# EAGLE board MotherBoard (EAGLE 8.1.0)
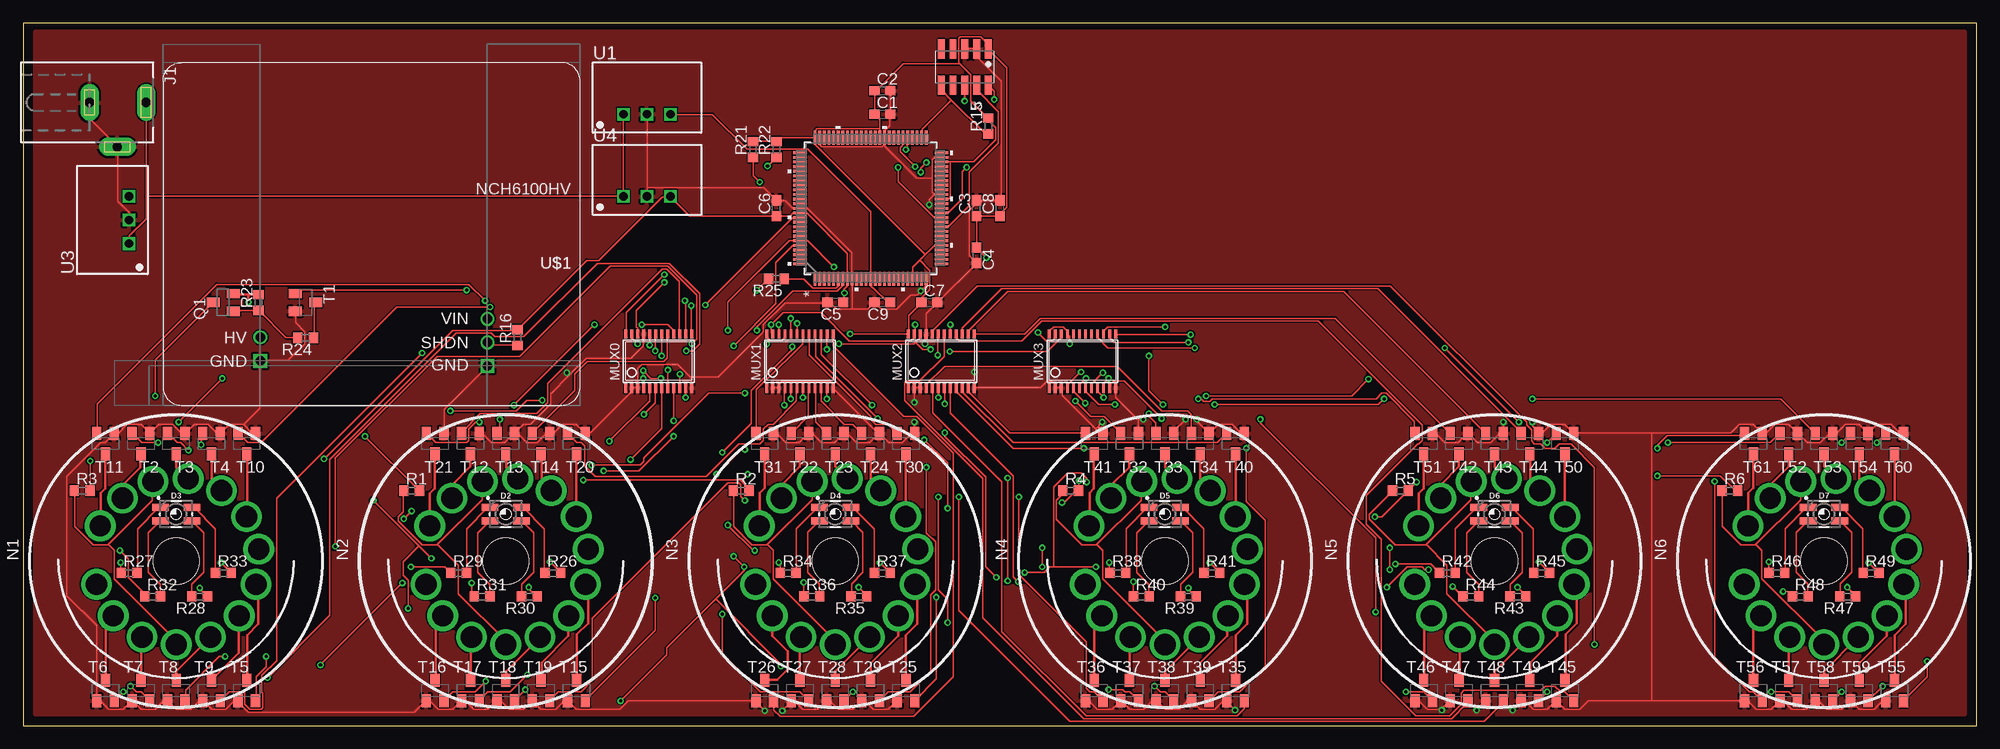
[diagram p6: board, top side]
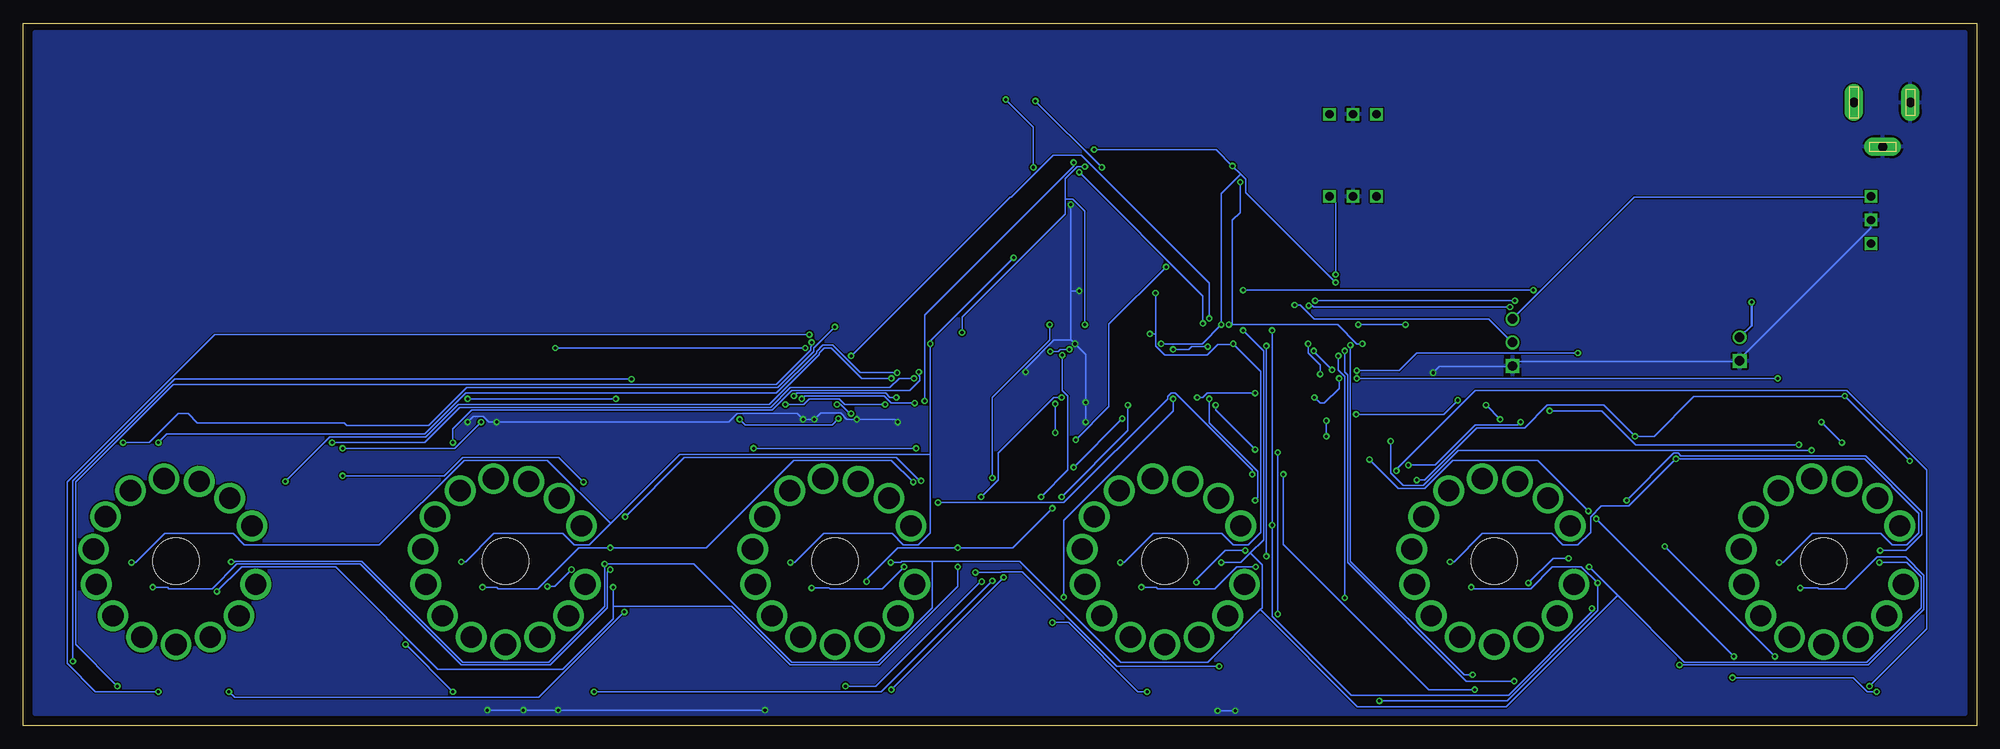
[diagram p7: board, bottom side, seen from below]

Size 210.8 x 75.87 mm. Coordinates in mm from the lower left corner, seen from the top.
Outline: 0,0 210.8,0 210.8,75.87 0,75.87 0,0
Copper layers (1*16): Top 0.0356mm / dielectric 1.5011mm / Bottom 0.0356mm
Design rules "oshpark-2layer": minimum track width 6mil, minimum drill 13mil, track to track 6mil, track to pad 6mil, pad to pad 6mil, via to via 6mil, smd to smd 6mil, copper to edge 15mil, drill to drill 6mil, minimum pad ring 7mil, minimum via ring 7mil, stop-mask expansion 2.5mil, vias tented up to drill 0mil, thermal gap 10mil
Net classes: 1 HV: width 0.254 mm, drill 0.254 mm, clearance 0.254 mm to class 0, clearance 0.254 mm

## Footprints (pad centres in the part's own frame; a part is rotated, then mirrored left to right if it is on the bottom)
C0603 = smd 1.1 x 1: 1 -0.85,0; 2 0.85,0
P-LCC-4-3 = smd 1.8 x 0.75: 1 -1.7,0.725; 2 -1.7,-0.725; 3 1.7,-0.725; 4 1.7,0.725
DCJ0202 = drill 1 pad 2 long: 1 0,3.1; 2 4.8,0; 3 0,-3
621X1021021 = smd 0.75 x 2.1: 1 -2.54,-1.95; 2 -1.27,-1.95; 3 0,-1.95; 4 1.27,-1.95; 5 2.54,-1.95; 6 2.54,1.95; 7 1.27,1.95; 8 0,1.95; 9 -1.27,1.95; 10 -2.54,1.95
TSSOP24 = smd 0.305 x 0.991: 1 -3.575,-2.918; 2 -2.925,-2.918; 3 -2.275,-2.918; 4 -1.625,-2.918; 5 -0.975,-2.918; 6 -0.325,-2.918; 7 0.325,-2.918; 8 0.975,-2.918; 9 1.625,-2.918; 10 2.275,-2.918; 11 2.925,-2.918; 12 3.575,-2.918; 13 3.575,2.918; 14 2.925,2.918; 15 2.275,2.918; 16 1.625,2.918; 17 0.975,2.918; 18 0.325,2.918; 19 -0.325,2.918; 20 -0.975,2.918; 21 -1.625,2.918; 22 -2.275,2.918; 23 -2.925,2.918; 24 -3.575,2.918
IN-18 = drill 2.3 pad 3.2: 0 5.8,-6.8; 1 -1.3,-8.9; 2 -4.9,-7.6; 3 -8.6,2.5; 4 6.8,5.9; 5 3.7,8.2; 6 -3.7,8.2; 7 -6.8,5.9; 8 -7.6,-4.8; 9 8.2,-3.8; A 0,9; A2 2.5,-8.6; N/C 8.6,2.5; N/C2 -8.9,-1.3 | hole 5: 0,0
SOT23 = smd 1 x 1.4: 1 -0.95,-1.1; 2 0.95,-1.1; 3 0,1.1
R0603 = smd 1 x 1.1: 1 -0.85,0; 2 0.85,0
SOT23-BEC = smd 1 x 1.4: B -0.95,-1.1; C 0,1.1; E 0.95,-1.1
SOT23-EBC = smd 1 x 1.4: B 0.95,-1.1; C 0,1.1; E -0.95,-1.1
TSR-1 = drill 0.9 square: 1 -2.54,0; 2 0,0; 3 2.54,0
LQFP-100_14X14X1.7 = smd 1.461 x 0.3: 1 -7.625,6; 2 -7.625,5.5; 3 -7.625,5; 4 -7.625,4.5; 5 -7.625,4; 6 -7.625,3.5; 7 -7.625,3; 8 -7.625,2.5; 9 -7.625,2; 10 -7.625,1.5; 11 -7.625,1; 12 -7.625,0.5; 13 -7.625,0; 14 -7.625,-0.5; 15 -7.625,-1; 16 -7.625,-1.5; 17 -7.625,-2; 18 -7.625,-2.5; 19 -7.625,-3; 20 -7.625,-3.5; 21 -7.625,-4; 22 -7.625,-4.5; 23 -7.625,-5; 24 -7.625,-5.5; 25 -7.625,-6; 51 7.625,-6; 52 7.625,-5.5; 53 7.625,-5; 54 7.625,-4.5; 55 7.625,-4; 56 7.625,-3.5; 57 7.625,-3; 58 7.625,-2.5; 59 7.625,-2; 60 7.625,-1.5; 61 7.625,-1; 62 7.625,-0.5; 63 7.625,0; 64 7.625,0.5; 65 7.625,1; 66 7.625,1.5; 67 7.625,2; 68 7.625,2.5; 69 7.625,3; 70 7.625,3.5; 71 7.625,4; 72 7.625,4.5; 73 7.625,5; 74 7.625,5.5; 75 7.625,6 | smd 0.3 x 1.461: 26 -6,-7.625; 27 -5.5,-7.625; 28 -5,-7.625; 29 -4.5,-7.625; 30 -4,-7.625; 31 -3.5,-7.625; 32 -3,-7.625; 33 -2.5,-7.625; 34 -2,-7.625; 35 -1.5,-7.625; 36 -1,-7.625; 37 -0.5,-7.625; 38 0,-7.625; 39 0.5,-7.625; 40 1,-7.625; 41 1.5,-7.625; 42 2,-7.625; 43 2.5,-7.625; 44 3,-7.625; 45 3.5,-7.625; 46 4,-7.625; 47 4.5,-7.625; 48 5,-7.625; 49 5.5,-7.625; 50 6,-7.625; 76 6,7.625; 77 5.5,7.625; 78 5,7.625; 79 4.5,7.625; 80 4,7.625; 81 3.5,7.625; 82 3,7.625; 83 2.5,7.625; 84 2,7.625; 85 1.5,7.625; 86 1,7.625; 87 0.5,7.625; 88 0,7.625; 89 -0.5,7.625; 90 -1,7.625; 91 -1.5,7.625; 92 -2,7.625; 93 -2.5,7.625; 94 -3,7.625; 95 -3.5,7.625; 96 -4,7.625; 97 -4.5,7.625; 98 -5,7.625; 99 -5.5,7.625; 100 -6,7.625
NCH6100-STD = drill 1 square: GND -12,15.75; GNDO 12.5,15.2 | drill 1: SHDN -12,13.21; VH 12.5,12.66; VIN -12,10.67

## Placement (x,y rotation side)
C1  0.1µF  [C0603]  92.71,66.04 0 top
C2  0.1µF  [C0603]  92.71,68.58 0 top
C3  0.1µF  [C0603]  102.87,55.88 90 top
C4  0.1µF  [C0603]  102.87,50.8 270 top
C5  0.1µF  [C0603]  87.63,45.72 180 top
C6  0.1µF  [C0603]  81.28,55.88 90 top
C7  0.1µF  [C0603]  97.79,45.72 0 top
C8  0.1µF  [C0603]  105.41,55.88 90 top
C9  10µF  [C0603]  92.71,45.72 180 top
D2  CLV1A-FKB-CJ1M1F1BB7R4S3  [P-LCC-4-3]  52.07,22.86 0 top
D3  CLV1A-FKB-CJ1M1F1BB7R4S3  [P-LCC-4-3]  16.51,22.86 0 top
D4  CLV1A-FKB-CJ1M1F1BB7R4S3  [P-LCC-4-3]  87.63,22.86 0 top
D5  CLV1A-FKB-CJ1M1F1BB7R4S3  [P-LCC-4-3]  123.19,22.86 0 top
D6  CLV1A-FKB-CJ1M1F1BB7R4S3  [P-LCC-4-3]  158.75,22.86 0 top
D7  CLV1A-FKB-CJ1M1F1BB7R4S3  [P-LCC-4-3]  194.31,22.86 0 top
J1  DCJ0202  [DCJ0202]  10.16,67.31 270 top
J2  M50-3600542  [621X1021021]  101.6,71.12 180 top
MUX0  PCA9555PW  [TSSOP24]  68.58,39.37 0 top
MUX1  PCA9555PW  [TSSOP24]  83.82,39.37 0 top
MUX2  PCA9555PW  [TSSOP24]  99.06,39.37 0 top
MUX3  PCA9555PW  [TSSOP24]  114.3,39.37 0 top
N1  IN-18  [IN-18]  16.51,17.78 180 top
N2  IN-18  [IN-18]  52.07,17.78 180 top
N3  IN-18  [IN-18]  87.63,17.78 180 top
N4  IN-18  [IN-18]  123.19,17.78 180 top
N5  IN-18  [IN-18]  158.75,17.78 180 top
N6  IN-18  [IN-18]  194.31,17.78 180 top
Q1  MPSA92  [SOT23]  21.59,45.72 90 top
R1  6.8k  [R0603]  41.91,25.4 0 top
R2  6.8k  [R0603]  77.47,25.4 0 top
R3  6.8k  [R0603]  6.35,25.4 0 top
R4  6.8k  [R0603]  113.03,25.4 0 top
R5  6.8k  [R0603]  148.59,25.4 0 top
R6  6.8k  [R0603]  184.15,25.4 0 top
R15  10k  [R0603]  104.14,64.77 90 top
R16  4.7k  [R0603]  53.34,41.91 90 top
R21  4.7k  [R0603]  78.74,62.23 90 top
R22  4.7k  [R0603]  81.28,62.23 90 top
R23  100k  [R0603]  25.4,45.72 90 top
R24  470k  [R0603]  30.48,41.91 180 top
R25  33k  [R0603]  81.28,48.26 180 top
R26  130  [R0603]  57.15,16.51 0 top
R27  576  [R0603]  11.43,16.51 0 top
R28  270  [R0603]  19.05,13.97 180 top
R29  576  [R0603]  46.99,16.51 0 top
R30  270  [R0603]  54.61,13.97 180 top
R31  270  [R0603]  49.53,13.97 0 top
R32  270  [R0603]  13.97,13.97 0 top
R33  130  [R0603]  21.59,16.51 0 top
R34  576  [R0603]  82.55,16.51 0 top
R35  270  [R0603]  90.17,13.97 180 top
R36  270  [R0603]  85.09,13.97 0 top
R37  130  [R0603]  92.71,16.51 0 top
R38  576  [R0603]  118.11,16.51 0 top
R39  270  [R0603]  125.73,13.97 180 top
R40  270  [R0603]  120.65,13.97 0 top
R41  130  [R0603]  128.27,16.51 0 top
R42  576  [R0603]  153.67,16.51 0 top
R43  270  [R0603]  161.29,13.97 180 top
R44  270  [R0603]  156.21,13.97 0 top
R45  130  [R0603]  163.83,16.51 0 top
R46  576  [R0603]  189.23,16.51 0 top
R47  270  [R0603]  196.85,13.97 180 top
R48  270  [R0603]  191.77,13.97 0 top
R49  130  [R0603]  199.39,16.51 0 top
T1  MPSA42  [SOT23-BEC]  30.48,45.72 270 top
T2  DN350T05-7  [SOT23-EBC]  12.7,30.48 180 top
T3  DN350T05-7  [SOT23-EBC]  16.51,30.48 180 top
T4  DN350T05-7  [SOT23-EBC]  20.32,30.48 180 top
T5  DN350T05-7  [SOT23-EBC]  24.13,3.81 0 top
T6  DN350T05-7  [SOT23-EBC]  8.89,3.81 0 top
T7  DN350T05-7  [SOT23-EBC]  12.7,3.81 0 top
T8  DN350T05-7  [SOT23-EBC]  16.51,3.81 0 top
T9  DN350T05-7  [SOT23-EBC]  20.32,3.81 0 top
T10  DN350T05-7  [SOT23-EBC]  24.13,30.48 180 top
T11  DN350T05-7  [SOT23-EBC]  8.89,30.48 180 top
T12  DN350T05-7  [SOT23-EBC]  48.26,30.48 180 top
T13  DN350T05-7  [SOT23-EBC]  52.07,30.48 180 top
T14  DN350T05-7  [SOT23-EBC]  55.88,30.48 180 top
T15  DN350T05-7  [SOT23-EBC]  59.69,3.81 0 top
T16  DN350T05-7  [SOT23-EBC]  44.45,3.81 0 top
T17  DN350T05-7  [SOT23-EBC]  48.26,3.81 0 top
T18  DN350T05-7  [SOT23-EBC]  52.07,3.81 0 top
T19  DN350T05-7  [SOT23-EBC]  55.88,3.81 0 top
T20  DN350T05-7  [SOT23-EBC]  59.69,30.48 180 top
T21  DN350T05-7  [SOT23-EBC]  44.45,30.48 180 top
T22  DN350T05-7  [SOT23-EBC]  83.82,30.48 180 top
T23  DN350T05-7  [SOT23-EBC]  87.63,30.48 180 top
T24  DN350T05-7  [SOT23-EBC]  91.44,30.48 180 top
T25  DN350T05-7  [SOT23-EBC]  95.25,3.81 0 top
T26  DN350T05-7  [SOT23-EBC]  80.01,3.81 0 top
T27  DN350T05-7  [SOT23-EBC]  83.82,3.81 0 top
T28  DN350T05-7  [SOT23-EBC]  87.63,3.81 0 top
T29  DN350T05-7  [SOT23-EBC]  91.44,3.81 0 top
T30  DN350T05-7  [SOT23-EBC]  95.25,30.48 180 top
T31  DN350T05-7  [SOT23-EBC]  80.01,30.48 180 top
T32  DN350T05-7  [SOT23-EBC]  119.38,30.48 180 top
T33  DN350T05-7  [SOT23-EBC]  123.19,30.48 180 top
T34  DN350T05-7  [SOT23-EBC]  127,30.48 180 top
T35  DN350T05-7  [SOT23-EBC]  130.81,3.81 0 top
T36  DN350T05-7  [SOT23-EBC]  115.57,3.81 0 top
T37  DN350T05-7  [SOT23-EBC]  119.38,3.81 0 top
T38  DN350T05-7  [SOT23-EBC]  123.19,3.81 0 top
T39  DN350T05-7  [SOT23-EBC]  127,3.81 0 top
T40  DN350T05-7  [SOT23-EBC]  130.81,30.48 180 top
T41  DN350T05-7  [SOT23-EBC]  115.57,30.48 180 top
T42  DN350T05-7  [SOT23-EBC]  154.94,30.48 180 top
T43  DN350T05-7  [SOT23-EBC]  158.75,30.48 180 top
T44  DN350T05-7  [SOT23-EBC]  162.56,30.48 180 top
T45  DN350T05-7  [SOT23-EBC]  166.37,3.81 0 top
T46  DN350T05-7  [SOT23-EBC]  151.13,3.81 0 top
T47  DN350T05-7  [SOT23-EBC]  154.94,3.81 0 top
T48  DN350T05-7  [SOT23-EBC]  158.75,3.81 0 top
T49  DN350T05-7  [SOT23-EBC]  162.56,3.81 0 top
T50  DN350T05-7  [SOT23-EBC]  166.37,30.48 180 top
T51  DN350T05-7  [SOT23-EBC]  151.13,30.48 180 top
T52  DN350T05-7  [SOT23-EBC]  190.5,30.48 180 top
T53  DN350T05-7  [SOT23-EBC]  194.31,30.48 180 top
T54  DN350T05-7  [SOT23-EBC]  198.12,30.48 180 top
T55  DN350T05-7  [SOT23-EBC]  201.93,3.81 0 top
T56  DN350T05-7  [SOT23-EBC]  186.69,3.81 0 top
T57  DN350T05-7  [SOT23-EBC]  190.5,3.81 0 top
T58  DN350T05-7  [SOT23-EBC]  194.31,3.81 0 top
T59  DN350T05-7  [SOT23-EBC]  198.12,3.81 0 top
T60  DN350T05-7  [SOT23-EBC]  201.93,30.48 180 top
T61  DN350T05-7  [SOT23-EBC]  186.69,30.48 180 top
U1  TSR_1-2450  [TSR-1]  67.31,66.04 0 top
U2  MK64FN1M0VLL12  [LQFP-100_14X14X1.7]  91.44,55.88 90 top
U3  TSR_1-24120  [TSR-1]  11.43,54.61 90 top
U4  TSR_1-2433  [TSR-1]  67.31,57.15 0 top
U$1  NCH6100HV  [NCH6100-STD]  38.1,54.61 180 top

## Tracks (layer width: path | path; a pad name or v marks a point on that pad's centre or on a via)
12VDC
  Bottom 0.152: U3.3 11.43,57.1 36.96,57.1 50.06,43.99 U$1.VIN
19VIN
  Top 0.152: U1.1 64.77,57.17 | U3.1 11.43,52.91 13.26,54.74 13.26,57.17 | 13.26,57.17 J1.1 | 13.26,57.17 64.77,57.17 | 64.77,57.17 U4.1
GND  (via drill 0.33)
  Top 0.152: T51.E 152.09,31.57 152.4,31.57 153.39,30.58 154.84,30.58 155.83,31.57 T42.E 155.91,31.57 156.9,30.58 158.34,30.58 159.33,31.57 159.64,31.57 T43.E 159.72,31.65 v159.72,32.79 | T60.E 202.84,31.65 202.46,31.65 201.55,32.56 200.03,32.56 199.11,31.65 T54.E 199.03,31.65 198.12,32.56 196.6,32.56 195.68,31.65 195.3,31.65 T53.E 195.22,31.57 194.92,31.57 193.93,30.58 192.48,30.58 191.49,31.57 T52.E 191.41,31.65 190.5,32.56 188.98,32.56 188.06,31.65 187.68,31.65 T61.E 187.6,31.65 186.69,32.56 185.17,32.56 184.25,31.65 175.72,31.65 | 175.72,31.65 167.34,31.65 T50.E 167.26,31.65 166.34,32.56 164.82,32.56 163.91,31.65 163.53,31.65 T44.E 163.53,31.73 162.84,32.41 v162.84,32.79 | T55.E 200.94,2.69 200.63,2.69 199.72,1.78 198.12,1.78 197.21,2.69 T59.E 197.13,2.69 196.22,1.78 194.62,1.78 193.7,2.69 193.4,2.69 T58.E 193.32,2.69 192.41,1.78 190.81,1.78 189.89,2.69 189.59,2.69 T57.E 189.51,2.69 188.59,1.78 187,1.78 186.08,2.69 185.78,2.69 T56.E 185.7,2.69 175.72,2.69 | T36.E 114.68,2.69 114.99,2.69 115.9,1.78 117.5,1.78 118.42,2.69 T37.E 118.49,2.69 119.41,1.78 120.93,1.78 121.84,2.69 122.22,2.69 T38.E 122.3,2.69 123.22,1.78 124.74,1.78 125.65,2.69 126.03,2.69 T39.E 126.11,2.69 127.03,1.78 128.55,1.78 129.46,2.69 129.84,2.69 T35.E 129.84,2.62 v130.76,1.7 | 153.05,1.82 153.92,2.69 T47.E | 153.05,1.82 153.01,1.78 151.49,1.78 150.57,2.69 150.19,2.69 T46.E | v156.82,1.7 156.82,1.78 157.73,2.69 T48.E | v153.09,1.7 153.09,1.78 153.05,1.82 | v160.71,1.7 161.62,2.62 T49.E 161.62,2.69 162,2.69 162.92,1.78 164.44,1.78 165.35,2.69 T45.E 165.43,2.69 166.34,1.78 167.94,1.78 168.86,2.69 175.72,2.69
  Top 0.152: 175.72,2.69 175.72,31.65 | 120.28,33.06 120.32,33.02 120.32,31.65 T32.E | 120.28,33.06 117.88,35.46 MUX3.12 | v125.42,33.1 124.21,31.88 124.21,31.65 T33.E | v126.64,33.1 126.64,32.94 127.94,31.65 T34.E 128.02,31.65 128.93,32.56 130.45,32.56 131.37,31.65 131.75,31.65 T40.E | v120.85,33.1 120.32,33.1 120.28,33.06 | 115.71,32.07 112.09,35.69 112.09,36.45 MUX3.3 112.01,36.52 111.4,36.52 MUX3.2 111.33,36.52 111.33,36.83 110.95,37.21 110.49,37.21 109.8,36.52 102.64,36.52 MUX2.12 102.64,36.6 v102.64,38.2 | 115.71,32.07 116.13,31.65 116.51,31.65 T41.E | 115.71,32.07 v116.43,32.79 | 98.26,57.44 98.07,57.63 98.07,59.16 | 98.26,57.44 98.3,57.4 99.06,57.4 U2.41 | 98.07,59.16 98.07,61.14 98.3,61.37 99.06,61.37 U2.49 | C2.2 93.57,68.53 93.57,66.09 C1.2 93.5,66.02 93.5,64.8 92.96,64.26 92.96,63.58 U2.60 92.89,63.5 92.89,62.74 92.85,62.7 | 92.85,62.7 92.66,62.51 86.18,62.51 85.95,62.74 85.95,63.5 U2.74 | 98.07,59.16 96.39,59.16 92.85,62.7 | MUX1.2 80.92,36.52 81.53,36.52 MUX1.3 81.53,36.6 81.53,36.83 81.92,37.21 87.02,37.21 87.33,36.91 87.33,36.52 MUX1.12 92.28,31.57 T24.E | MUX2.3 96.77,36.52 96.16,36.52 MUX2.2 96.16,36.45 v96.16,34.92 | v96.16,32.79 96.16,31.65 T30.E 96.09,31.65 95.94,31.65 94.87,30.58 93.42,30.58 92.43,31.57 T24.E | T31.E 81,31.57 81.31,31.57 82.3,30.58 83.74,30.58 84.73,31.57 T22.E 84.81,31.57 85.11,31.57 86.11,30.58 87.55,30.58 88.54,31.57 T23.E 88.62,31.57 88.92,31.57 89.92,30.58 91.36,30.58 92.35,31.57 T24.E | J2.3 101.65,73.1 102.87,73.1 J2.2 102.87,72.26 105.54,69.6 105.54,56.87 105.46,56.79 C8.2 105.39,56.72 102.87,56.72 | 102.87,56.72 102.87,56.41 102.11,55.65 102.11,50.77 102.87,50.01 C4.2 102.87,49.94 98.68,45.74 C7.2 98.6,45.67 97.46,44.53 97.46,42.32 MUX2.21 97.38,42.24 97.31,42.16 v97.31,41.25
  Top 0.152: 102.87,56.72 C3.2 | v97.77,56.26 97.77,56.79 98.22,57.25 98.22,57.4 98.26,57.44 | T25.E 94.26,2.69 93.34,1.78 91.75,1.78 90.83,2.69 90.53,2.69 T29.E 90.45,2.69 89.53,1.78 87.94,1.78 87.02,2.69 86.72,2.69 T28.E 86.64,2.69 85.72,1.78 84.12,1.78 83.21,2.69 82.91,2.69 T27.E 82.91,2.62 v81.92,1.63 | v80.01,1.63 79.02,2.62 T26.E 79.02,2.69 65.3,2.69 64.39,1.78 59.66,1.78 58.75,2.69 T15.E 58.67,2.69 58.37,2.69 57.45,1.78 55.85,1.78 54.94,2.69 T19.E 54.86,2.69 53.95,1.78 52.43,1.78 51.51,2.69 51.13,2.69 T18.E 51.05,2.69 50.14,1.78 48.62,1.78 47.7,2.69 47.32,2.69 T17.E 47.24,2.69 46.33,1.78 44.81,1.78 43.89,2.69 43.51,2.69 T16.E 43.43,2.69 42.22,1.47 24.31,1.47 23.16,2.62 T5.E 23.16,2.69 22.78,2.69 21.87,1.78 20.34,1.78 19.43,2.69 T9.E 19.36,2.69 18.97,2.69 18.06,1.78 16.54,1.78 15.62,2.69 T8.E 15.54,2.69 15.16,2.69 14.25,1.78 12.72,1.78 11.81,2.69 T7.E 11.73,2.69 10.82,1.78 9.22,1.78 8.31,2.69 8,2.69 T6.E 7.92,2.77 7.92,10.85 4.72,14.05 4.72,26.92 8.38,30.58 8.84,30.58 T11.E 9.91,31.65 10.29,31.65 11.2,32.56 12.72,32.56 13.64,31.65 T2.E 13.72,31.65 14.63,32.56 16.15,32.56 17.07,31.65 17.45,31.65 T3.E 17.53,31.65 18.44,32.56 19.96,32.56 20.88,31.65 21.26,31.65 T4.E 21.34,31.65 22.25,32.56 23.77,32.56 23.81,32.52 | U3.2 11.43,55.42 10.21,56.64 10.21,62.51 J1.2 10.13,62.59 7.16,65.56 J1.3 | T1.E 29.41,44.76 29.41,43.54 30.4,42.55 30.4,41.25 28.57,39.42 U$1.GNDO 25.53,39.34 25.53,34.24 23.81,32.52 | 23.81,32.52 24.69,31.65 25.07,31.65 T10.E | T21.E 45.41,31.65 45.41,34.16 50.06,38.81 U$1.GND | 72.05,37.63 70.64,39.04 66.75,39.04 66.29,38.58 66.29,36.6 MUX0.3 66.29,36.52 65.68,36.52 MUX0.2 65.61,36.45 65.61,36.07 61.19,31.65 60.66,31.65 T20.E 60.58,31.65 59.66,32.56 58.14,32.56 57.23,31.65 56.84,31.65 T14.E 56.77,31.57 56.46,31.57 55.47,30.58 54.33,30.58 53.19,31.73 T13.E
  Top 0.152: 72.05,37.63 72.08,37.59 72.08,36.52 MUX0.12 | 58.94,37.86 56.92,35.84 56.92,34.77 54.71,32.56 53.95,32.56 53.03,31.65 T13.E | 58.94,37.86 60.73,39.65 65.53,39.65 66.9,41.02 66.9,42.24 MUX0.21 | T12.E 49.23,31.57 49.53,31.57 50.52,30.58 51.97,30.58 52.96,31.57 T13.E | 58.94,37.86 v58.67,38.12 | 67.36,58.09 67.36,66.02 U1.2 | 67.36,58.09 67.36,57.17 U4.2 | 89.46,44.98 91.14,44.98 91.82,45.67 C9.2 91.9,45.67 92.58,44.98 94.26,44.98 95.78,46.51 96.47,46.51 96.89,46.93 | 89.46,44.98 87.78,44.98 87.1,45.67 86.79,45.67 C5.2 86.72,45.67 82.22,45.67 79.86,43.31 79.86,42.55 74.98,37.67 72.08,37.67 72.05,37.63 | 89.46,44.98 89.46,48.18 U2.9 89.38,48.26 89.38,51.08 84.58,55.88 U2.88 83.06,55.88 82.22,56.72 81.31,56.72 C6.2 81.23,56.79 79.93,58.09 67.36,58.09 | 96.89,46.93 97.38,47.42 97.38,48.18 U2.25 | v96.85,46.97 96.89,46.93
  Bottom 0.152: v162.84,32.79 162.23,33.4 161.16,33.4 160.55,32.79 v159.72,32.79 134.65,32.79 133.73,33.71 127.25,33.71 v126.64,33.1 v125.42,33.1 124.74,33.78 122.61,33.78 121.92,33.1 v120.85,33.1 116.74,33.1 v116.43,32.79 | v160.71,1.7 v156.82,1.7 v153.09,1.7 v130.76,1.7 | v96.16,32.79 v96.16,34.92 96.16,40.11 v97.31,41.25 97.73,41.67 | 97.77,46.97 97.77,41.71 97.73,41.67 | 97.77,46.97 v97.77,56.26 | v102.64,38.2 102.64,38.58 99.59,41.63 97.77,41.63 97.73,41.67 | v80.01,1.63 v81.92,1.63 | U3.2 11.43,53.75 25.53,39.65 25.53,39.42 U$1.GNDO 25.6,39.34 49.61,39.34 50.06,38.89 U$1.GND 50.14,38.81 57.99,38.81 v58.67,38.12 | v96.85,46.97 97.77,46.97
  pour Bottom: 1.27,1.27 209.55,1.27 209.55,74.93 1.27,74.93
  pour Top: 1.27,1.27 209.55,1.27 209.55,74.93 1.27,74.93
LED_B  (via drill 0.33)
  Top 0.152: v19.05,14.88 19.05,14.81 19.89,13.97 R28.1 | v40.92,15.42 v32.08,6.58 | v54.56,14.96 54.56,14.81 55.4,13.97 R30.1 | v90.14,14.96 90.98,14.12 90.98,13.97 R35.1 | 74.71,13.7 69.42,8.41 69.42,7.64 v64.47,2.69 | 74.71,13.7 77.8,16.79 v77.8,17.17 v76.66,18.31 | v125.73,14.88 125.73,14.81 126.57,13.97 R39.1 | 111.18,17.17 110.8,17.17 110.19,16.56 v108.05,16.56 | 111.18,17.17 v115.75,17.17 | v81.76,6.43 81.76,6.66 74.71,13.7 | v161.24,14.96 162.08,14.12 162.08,13.97 R43.1 | v114.76,26.31 114.76,26.7 114.15,27.3 112.7,27.3 111.18,25.78 111.18,17.17 | v196.82,14.96 197.66,14.12 197.66,13.97 R47.1 | v147.45,19.23 v147.45,16.87 | v76.66,41.02 81.23,45.59 81.23,50.01 83.06,51.84 83.74,51.84 U2.96
  Bottom 0.152: v19.05,14.88 17.14,14.88 17.07,14.81 14.17,14.81 10.74,18.24 7.7,18.24 5.71,16.26 5.71,12.6 11.73,6.58 v32.08,6.58 | v54.56,14.96 54.41,14.81 48.16,14.81 45.8,17.17 42.67,17.17 v40.92,15.42 40.92,12.45 50.67,2.69 v64.47,2.69 | v90.14,14.96 88.54,14.96 88.39,14.81 82.22,14.81 79.86,17.17 v77.8,17.17 | v125.73,14.88 123.83,14.88 123.75,14.81 118.11,14.81 v115.75,17.17 | v108.05,16.56 105.31,16.56 105.23,16.64 103.02,16.64 92.81,6.43 v81.76,6.43 | v161.24,14.96 159.72,14.96 159.56,14.81 155.3,14.81 150.88,19.23 v147.45,19.23 137.08,19.23 127.64,28.68 117.12,28.68 v114.76,26.31 | v196.82,14.96 195.22,14.96 195.07,14.81 190.42,14.81 187.76,17.48 174.42,17.48 163.53,6.58 153.92,6.58 147.75,12.75 147.75,16.56 v147.45,16.87 | v76.66,18.31 v76.66,41.02
LED_G  (via drill 0.33)
  Top 0.152: v10.44,18.92 11.35,18.01 11.35,16.03 13.11,14.28 13.11,13.97 R32.1 | v44.04,18.09 42.71,19.42 | 42.71,19.42 v37.8,24.33 | v48.39,15.42 48.39,14.2 48.62,13.97 R31.1 | v154.23,15.04 155.3,13.97 R44.1 | v151.64,16.87 151.26,16.87 150.95,17.17 149.35,17.17 v147.14,14.96 | v189.89,14.5 190.35,14.5 190.88,13.97 R48.1 | v84.2,15.49 84.2,13.97 R36.1 | v78.94,18.92 78.79,18.92 v76.05,21.67 | v76.05,42.7 76.05,45.74 82.68,52.38 83.74,52.38 U2.95 84.66,52.38 v87.48,49.55 | v119.79,15.57 119.79,13.97 R40.1 | v99.75,23.5 99.75,28.37 v97.23,30.89 | v109.96,19.23 v109.96,17.17 | 42.71,19.42 41,17.7 41,16.26 41.53,15.72 v41.53,12.68
  Bottom 0.152: v10.44,18.92 7.7,18.92 5.94,20.68 5.94,23.11 11.96,29.13 31.93,29.13 32.23,29.44 32.69,29.44 v37.8,24.33 | v44.04,18.09 45.72,18.09 v48.39,15.42 | v154.23,15.04 153.47,15.04 v151.64,16.87 | 147.14,12.9 147.14,11.53 152.55,6.12 166.04,6.12 177.09,17.17 187.22,17.17 v189.89,14.5 | 147.14,12.9 v147.14,14.96 | v84.2,15.49 84.2,15.8 81.08,18.92 v78.94,18.92 | v76.05,42.7 v76.05,21.67 76.05,11.84 67.51,3.3 50.52,3.3 41.53,12.29 v41.53,12.68 | v119.79,15.57 119.79,15.88 116.43,19.23 v109.96,19.23 104.01,19.23 v99.75,23.5 | v97.23,30.89 93.65,34.47 93.65,43.38 v87.48,49.55 | 147.14,12.9 134.34,12.9 128.02,6.58 118.42,6.58 109.96,15.04 v109.96,17.17
LED_R  (via drill 0.33)
  Top 0.152: v10.52,17.63 10.52,16.56 R27.1 | v41.83,17.17 45.49,17.17 46.1,16.56 R29.1 | v81.53,17.63 81.69,17.48 81.69,16.56 R34.1 | v79.17,42.7 79.17,43.08 83.06,46.97 87.86,46.97 88.39,47.5 88.39,48.18 U2.7 | v117.2,17.63 117.2,16.56 R38.1 | v148.06,17.48 151.87,17.48 152.78,16.56 R42.1 | v188.37,17.7 188.37,16.56 R46.1
  Bottom 0.152: v10.52,17.63 7.54,17.63 6.02,16.1 6.02,12.75 11.89,6.88 31.55,6.88 38.75,14.08 | v41.83,17.17 38.75,14.08 | v81.53,17.63 79.4,17.63 78.37,18.66 | 78.37,18.66 76.96,20.07 76.96,40.49 v79.17,42.7 | v117.2,17.63 116.13,17.63 115.98,17.78 112.7,17.78 | 112.7,17.78 103.25,17.78 92.35,6.88 82.98,6.88 77.31,12.56 | 77.31,12.56 77.11,12.75 77.11,17.4 78.37,18.66 | 112.7,17.78 112.7,12.75 118.57,6.88 127.86,6.88 138.46,17.48 v148.06,17.48 148.06,12.9 154.08,6.88 163.37,6.88 174.27,17.78 187.91,17.78 187.99,17.7 v188.37,17.7 | 38.75,14.08 50.75,2.08 66.83,2.08 77.31,12.56
MUX000  (via drill 0.33)
  Top 0.152: v66.9,37.52 66.9,36.52 MUX0.4 | v16.76,32.79 v21.49,37.52 | v14.55,30.58 12.8,30.58 11.81,31.57 T2.B
  Bottom 0.152: v21.49,37.52 v66.9,37.52 | v14.55,30.58 v16.76,32.79
MUX001  (via drill 0.33)
  Top 0.152: v63.25,30.73 67.59,35.08 67.59,36.45 MUX0.5 | v17.83,29.74 16.99,30.58 16.61,30.58 15.62,31.57 T3.B
  Bottom 0.152: v63.25,30.73 63.25,27.3 61.87,25.93 59.74,25.93 55.93,29.74 v17.83,29.74
MUX002  (via drill 0.33)
  Top 0.152: v66.98,33.63 68.2,34.85 68.2,36.45 MUX0.6 | v56.01,35.15 54.33,35.15 53.19,34.01 v46.1,34.01 | v19.2,30.35 19.2,31.42 19.36,31.57 T4.B
  Bottom 0.152: v66.98,33.63 57.53,33.63 v56.01,35.15 | v46.1,34.01 40.46,34.01 36.8,30.35 v19.2,30.35
MUX003  (via drill 0.33)
  Top 0.152: v65.53,28.75 68.89,32.11 68.89,36.45 MUX0.7 | v41.07,22.35 v41.91,23.19 | v26.21,7.49 26.21,6.35 25.15,5.28 25.15,2.77 T5.B
  Bottom 0.152: v65.53,28.75 62.41,25.63 59.59,25.63 56.54,28.68 47.4,28.68 v41.91,23.19 | v26.21,7.49 v41.07,22.35
MUX004  (via drill 0.33)
  Top 0.152: v69.57,38.43 69.57,36.52 MUX0.8 | v71.55,40.49 72.24,40.49 73,41.25 73,46.66 69.72,49.94 61.95,49.94 54.03,42.01 50.9,42.01 50.52,42.39 46.71,42.39 33.07,28.75 33.07,11.91 v26.36,5.21 | v10.82,3.68 9.91,2.77 T6.B
  Bottom 0.152: v69.57,38.43 71.55,40.41 v71.55,40.49 | v26.36,5.21 13.34,5.21 11.81,3.68 v10.82,3.68
MUX005  (via drill 0.33)
  Top 0.152: v70.18,32.94 70.18,36.45 MUX0.9 | v70.18,31.27 66.45,27.53 v62.64,27.53 | v11.58,4.29 12.19,3.68 12.72,3.68 13.64,2.77 T7.B
  Bottom 0.152: v70.18,31.27 v70.18,32.94 | v62.64,27.53 62.64,27.69 54.1,36.22 14.02,36.22 5.41,27.61 5.41,10.46 v11.58,4.29
MUX006  (via drill 0.33)
  Top 0.152: v70.87,37.97 70.87,36.52 MUX0.10 | v72.16,41.25 72.69,41.78 72.69,46.51 69.57,49.63 63.32,49.63 53.57,39.88 44.65,39.88 33.68,28.91 v33.68,19.38 | v21.79,7.49 21.18,7.49 17.53,3.83 17.53,2.77 T8.B
  Bottom 0.152: v70.87,37.97 70.87,38.96 72.16,40.26 v72.16,41.25 | v21.79,7.49 v33.68,19.38
MUX007  (via drill 0.33)
  Top 0.152: v71.48,35.46 71.48,36.45 MUX0.11 | v68.81,37.52 67.74,37.52 v66.9,38.35 | v43.05,40.26 27.36,24.56 27.36,7.04 25.76,5.44 25.76,3.61 25.83,3.53 25.83,1.93 25.68,1.78 24.46,1.78 23.93,2.31 23.93,3.53 23.77,3.68 22.25,3.68 21.34,2.77 T9.B
  Bottom 0.152: v71.48,35.46 70.87,34.85 70.41,34.85 68.81,36.45 v68.81,37.52 | v66.9,38.35 62.33,38.35 60.43,40.26 v43.05,40.26
MUX010  (via drill 0.33)
  Top 0.152: v72.08,45.36 72.08,42.32 MUX0.13 | v50.37,45.21 40.31,45.21 25.68,30.58 24.23,30.58 23.24,31.57 T10.B
  Bottom 0.152: v72.08,45.36 71.7,45.36 71.55,45.21 v50.37,45.21
MUX011  (via drill 0.33)
  Top 0.152: v71.4,45.9 71.48,45.82 71.48,42.32 MUX0.14 | v49.84,45.9 48.08,47.65 20.88,47.65 8,34.77 8,31.65 T11.B
  Bottom 0.152: v49.84,45.9 v71.4,45.9
MUX012
  Top 0.152: MUX0.15 70.79,42.32 70.79,47.95 69.42,49.33 68.96,49.33 56.62,36.98 56.62,34.92 55.4,33.71 49.3,33.71 47.24,31.65 T12.B
MUX013  (via drill 0.33)
  Top 0.152: v66.75,43.31 69.57,43.31 70.18,42.7 70.18,42.32 MUX0.16 | v52.96,34.62 v61.65,43.31 | v51.44,33.1 51.44,31.95 51.13,31.65 T13.B
  Bottom 0.152: v61.65,43.31 v66.75,43.31 | v51.44,33.1 v52.96,34.62
MUX014
  Top 0.152: MUX0.17 69.49,42.24 69.49,39.73 69.11,39.34 60.88,39.34 59.51,37.97 59.51,36.22 54.94,31.65 T14.B
MUX015  (via drill 0.33)
  Top 0.152: v68.89,39.95 68.89,42.24 MUX0.18 | v68.2,13.82 68.2,10.31 60.66,2.77 T15.B
  Bottom 0.152: v68.89,39.95 68.89,38.43 68.2,37.74 v68.2,13.82
MUX016  (via drill 0.33)
  Top 0.152: v68.2,40.49 68.2,42.24 MUX0.19 | v49.91,4.83 48.77,3.68 46.33,3.68 45.41,2.77 T16.B
  Bottom 0.152: v68.2,40.49 68.2,38.2 67.89,37.9 67.89,17.63 55.09,4.83 v49.91,4.83
MUX017  (via drill 0.33)
  Top 0.152: v67.59,41.1 67.59,42.24 MUX0.20 | v54.41,5.51 52.58,3.68 50.14,3.68 49.23,2.77 T17.B
  Bottom 0.152: v67.59,41.1 67.59,17.78 55.32,5.51 v54.41,5.51
MUX100  (via drill 0.33)
  Top 0.152: v82.14,34.62 82.14,36.45 MUX1.4 | v77.88,29.82 77.5,29.82 v74.83,27.15 | v54.18,3.91 53.03,2.77 T18.B
  Bottom 0.152: v82.14,34.62 82.14,34.09 v77.88,29.82 | v74.83,27.15 74.83,19.61 59.13,3.91 v54.18,3.91
MUX101  (via drill 0.33)
  Top 0.152: v82.83,35.31 82.83,36.45 MUX1.5 | v77.88,24.33 77.42,24.79 77.42,26.01 77.19,26.24 76.05,26.24 61.42,11.61 61.42,4.9 60.2,3.68 57.76,3.68 56.84,2.77 T19.B
  Bottom 0.152: v82.83,35.31 82.83,32.72 77.57,27.46 77.57,24.64 v77.88,24.33
MUX102
  Top 0.152: MUX1.6 83.44,36.45 83.44,35.08 80.92,32.56 80.39,32.56 79.86,32.03 79.86,30.81 79.48,30.43 77.19,30.43 73.69,26.92 61.72,26.92 60.58,28.07 60.58,30.2 60.2,30.58 59.74,30.58 T20.B
MUX103  (via drill 0.33)
  Top 0.152: v84.12,35.46 84.12,36.45 MUX1.7 | v77.88,35.92 73.99,35.92 66.98,28.91 66.98,28.52 66.6,28.14 v61.34,28.14 | v49.23,32.79 48.84,32.79 48.08,32.03 48.08,30.81 47.85,30.58 44.5,30.58 T21.B
  Bottom 0.152: v84.12,35.46 83.52,35.46 83.06,35.92 v77.88,35.92 | v61.34,28.14 58.45,28.14 54.1,32.49 49.53,32.49 v49.23,32.79
MUX104
  Top 0.152: MUX1.8 84.73,36.45 84.73,33.48 82.91,31.65 T22.B
MUX105
  Top 0.152: MUX1.9 85.5,36.45 85.5,32.79 86.64,31.65 T23.B
MUX106
  Top 0.152: MUX1.10 86.11,36.45 86.11,35.08 88.62,32.56 89.53,32.56 90.45,31.65 T24.B
MUX107  (via drill 0.33)
  Top 0.152: v86.72,35.31 86.72,36.45 MUX1.11 | v98.53,13.89 98.53,5.05 96.24,2.77 T25.B
  Bottom 0.152: v86.72,35.31 86.72,34.01 98.53,22.2 v98.53,13.89
MUX110
  Top 0.152: MUX1.13 87.4,42.24 87.4,41.02 95.02,33.4 96.39,33.4 100.36,29.44 100.36,5.28 96.09,1.02 81.69,1.02 81,1.7 81,2.69 T26.B
MUX111  (via drill 0.33)
  Top 0.152: v86.72,40.64 86.72,42.24 MUX1.14 | v82.98,40.95 82.98,40.64 78.56,36.22 78.56,32.64 v75.44,29.52 | v75.44,12.06 75.44,7.8 79.55,3.68 83.82,3.68 84.73,2.77 T27.B
  Bottom 0.152: v86.72,40.64 85.04,40.64 84.73,40.95 v82.98,40.95 | v75.44,12.06 v75.44,29.52
MUX112  (via drill 0.33)
  Top 0.152: v91.59,34.62 86.11,40.11 86.11,42.24 MUX1.15 | v98.75,24.71 98.75,14.66 99.75,13.66 v99.75,11.15 | v89.53,3.68 88.62,2.77 T28.B
  Bottom 0.152: v91.59,34.62 91.59,31.88 v98.75,24.71 | v99.75,11.15 97.99,11.15 90.53,3.68 v89.53,3.68
MUX113  (via drill 0.33)
  Top 0.152: v92.2,33.17 85.5,39.88 85.5,42.24 MUX1.16 | v97.46,27.91 97.46,20.83 98.45,19.84 98.45,14.66 97.92,14.12 97.92,5.89 95.71,3.68 93.34,3.68 92.43,2.77 T29.B
  Bottom 0.152: v97.46,27.91 v92.2,33.17
MUX114
  Top 0.152: MUX1.17 84.81,42.24 84.81,40.03 91.44,33.4 91.44,33.1 91.97,32.56 93.34,32.56 94.26,31.65 T30.B
MUX115
  Top 0.152: MUX1.18 84.12,42.24 84.12,41.25 80.09,37.21 80.01,37.21 79.1,36.3 79.1,31.65 T31.B
MUX116  (via drill 0.33)
  Top 0.152: v83.52,43.46 83.52,42.32 MUX1.19 | v96.85,59.77 96.85,60.22 v97.46,60.83 | v113.54,35.08 115.21,33.4 116.66,33.4 118.42,31.65 T32.B
  Bottom 0.152: v83.52,43.46 83.52,46.43 v96.85,59.77 | v97.46,60.83 97.46,60.45 113.54,44.37 v113.54,35.08
MUX117  (via drill 0.33)
  Top 0.152: v82.83,43.99 82.83,42.32 MUX1.20 | v121.46,39.95 121.46,36.22 v122.99,34.7 | v121.46,33.71 121.46,33.48 122.22,32.72 122.22,31.65 T33.B
  Bottom 0.152: v82.83,43.99 82.83,47.8 96.62,61.59 99.67,61.59 104.17,57.1 104.32,57.1 v121.46,39.95 | v122.99,34.7 122.61,34.7 121.61,33.71 v121.46,33.71
MUX200
  Top 0.152: MUX2.4 97.46,36.52 97.46,36.83 99.44,38.81 118.03,38.81 122.83,34.01 125.65,34.01 126.03,33.63 126.03,31.65 T34.B
MUX201
  Top 0.152: MUX2.5 98.15,36.45 98.15,33.78 105.61,26.31 105.61,10.16 114.68,1.09 130.99,1.09 131.75,1.85 131.75,2.69 T35.B
MUX202  (via drill 0.33)
  Top 0.152: v98.75,35.46 98.75,36.45 MUX2.6 | v107.44,24.71 107.44,16.33 114.68,9.09 114.68,4.06 115.06,3.68 115.59,3.68 116.51,2.77 T36.B
  Bottom 0.152: v98.75,35.46 99.59,35.46 105.61,29.44 105.61,26.54 v107.44,24.71
MUX203  (via drill 0.33)
  Top 0.152: v99.44,34.77 99.44,36.45 MUX2.7 | v99.44,31.65 99.44,31.27 103.86,26.85 103.86,17.17 v105,16.03 | v117.12,3.91 118.64,3.91 118.87,3.68 119.41,3.68 120.32,2.77 T37.B
  Bottom 0.152: v99.44,31.65 v99.44,34.77 | v117.12,3.91 v105,16.03
MUX204  (via drill 0.33)
  Top 0.152: v107.37,15.57 106.83,16.1 106.83,27 100.05,33.78 100.05,36.45 MUX2.8 | v122.07,4.29 122.68,3.68 123.22,3.68 124.13,2.77 T38.B
  Bottom 0.152: v107.37,15.57 107.52,15.57 118.8,4.29 v122.07,4.29
MUX205  (via drill 0.33)
  Top 0.152: v114.45,29.97 106.83,29.97 100.74,36.07 100.74,36.45 MUX2.9 | v131.98,29.97 131.98,24.26 134.04,22.2 134.04,6.43 131.29,3.68 128.93,3.68 128.02,2.77 T39.B
  Bottom 0.152: v131.98,29.97 v114.45,29.97
MUX206
  Top 0.152: MUX2.10 101.35,36.07 106.83,30.58 128.85,30.58 129.84,31.57 T40.B
MUX207
  Top 0.152: MUX2.11 102.03,36.45 102.03,36.07 106.45,31.65 114.61,31.65 T41.B
MUX210
  Top 0.152: MUX2.13 102.64,42.32 108.05,42.32 109.73,43.99 141.58,43.99 153.92,31.65 T42.B
MUX211
  Top 0.152: MUX2.14 102.03,42.32 102.03,42.7 106.22,46.89 142.49,46.89 157.73,31.65 T43.B
MUX212
  Top 0.152: MUX2.15 101.35,42.32 101.35,42.93 105.61,47.19 146.15,47.19 161.54,31.8 161.54,31.65 T44.B
MUX213
  Top 0.152: MUX2.16 100.74,42.24 100.74,41.86 101.04,41.55 107.75,41.55 109.88,43.69 139.75,43.69 150.95,32.49 150.95,30.81 150.57,30.43 150.5,30.43 144.93,24.87 144.93,21.74 146.53,20.14 146.53,4.83 150.27,1.09 153.92,1.09 155.14,2.31 155.14,3.53 155.45,3.83 163.75,3.83 164.21,4.29 165.28,4.29 165.89,3.68 166.34,3.68 167.26,2.77 T45.B
MUX214  (via drill 0.33)
  Top 0.152: v100.05,43.31 100.05,42.32 MUX2.17 | v106.22,15.65 v106.22,26.77 | v149.2,3.68 151.1,3.68 152.02,2.77 T46.B
  Bottom 0.152: v100.05,43.31 100.05,41.63 106.22,35.46 v106.22,26.77 | v106.22,15.65 118.19,3.68 v149.2,3.68
MUX215
  Top 0.152: MUX2.18 99.36,42.24 99.36,39.88 96.7,37.21 95.25,37.21 95.1,37.06 95.1,35.15 103.56,26.7 103.56,11.68 114.45,0.79 154.15,0.79 155.83,2.46 155.83,2.69 T47.B
MUX216  (via drill 0.33)
  Top 0.152: v98.68,40.03 98.68,42.24 MUX2.19 | v100.97,24.71 100.97,12.45 112.93,0.48 157.66,0.48 159.64,2.46 159.64,2.69 T48.B
  Bottom 0.152: v98.68,40.03 98.68,36.22 98.07,35.61 98.07,27.61 v100.97,24.71
MUX217  (via drill 0.33)
  Top 0.152: v169.54,8.79 169.54,27.91 167.03,30.43 165.74,30.43 165.28,29.97 164.21,29.97 163.75,30.43 163.07,30.43 162.76,30.73 162.76,31.95 162.23,32.49 162.23,32.79 147.52,47.5 102.95,47.5 98.15,42.7 98.15,42.32 MUX2.20 | v164.44,3.68 163.53,2.77 T49.B
  Bottom 0.152: v164.44,3.68 v169.54,8.79
MUX300  (via drill 0.33)
  Top 0.152: v114.15,38.2 114.07,38.2 112.7,36.83 112.7,36.52 MUX3.4 | v164.44,30.58 T50.B
  Bottom 0.152: v114.15,38.2 114.15,37.82 114.07,37.74 114.07,37.29 115.14,36.22 127.86,36.22 130,34.09 162.38,34.09 164.44,32.03 v164.44,30.58
MUX301  (via drill 0.33)
  Top 0.152: v114.61,34.85 113.39,36.07 113.39,36.45 MUX3.5 | v126.8,35.31 127.1,35.31 127.41,35 128.02,35 128.32,35.31 146,35.31 146.61,35.92 147.07,35.92 150.11,32.87 150.11,31.65 T51.B
  Bottom 0.152: v114.61,34.85 117.12,34.85 117.88,35.61 126.49,35.61 v126.8,35.31
MUX302  (via drill 0.33)
  Top 0.152: v114.68,37.52 114,36.83 114,36.52 MUX3.6 | v177.47,30.58 188.52,30.58 189.51,31.57 T52.B
  Bottom 0.152: v114.68,37.52 116.28,37.52 117.27,36.52 128.02,36.52 130.15,34.39 163.68,34.39 167.49,30.58 v177.47,30.58
MUX303  (via drill 0.33)
  Top 0.152: v117.81,34.7 116.05,34.7 114.68,36.07 114.68,36.45 MUX3.7 | v128.55,34.7 146.23,34.7 v146.84,35.31 | v162.84,35.31 189.66,35.31 193.32,31.65 T53.B
  Bottom 0.152: v117.81,34.7 122.15,34.7 122.76,35.31 125.96,35.31 126.57,34.7 v128.55,34.7 | v162.84,35.31 v146.84,35.31
MUX304  (via drill 0.33)
  Top 0.152: v116.51,38.12 115.29,36.91 115.29,36.52 MUX3.8 | v196.22,30.58 197.21,31.57 T54.B
  Bottom 0.152: v116.51,38.12 120.47,38.12 123.44,41.1 124.51,41.1 125.2,40.41 125.2,40.26 129.54,35.92 163.07,35.92 167.49,31.5 195.3,31.5 v196.22,30.58
MUX305  (via drill 0.33)
  Top 0.152: v116.59,35.46 115.98,36.07 115.98,36.45 MUX3.9 | v127.64,35.61 143.33,35.61 v145.16,37.44 | v205.44,6.96 205.44,5.28 202.92,2.77 T55.B
  Bottom 0.152: v116.59,35.46 117.27,35.46 117.73,35.92 127.33,35.92 v127.64,35.61 | v145.16,37.44 194.46,37.44 205.44,26.47 v205.44,6.96
MUX306  (via drill 0.33)
  Top 0.152: v117.12,37.52 116.59,36.98 116.59,36.52 MUX3.10 | v182.5,26.39 182.5,7.42 186.23,3.68 186.69,3.68 187.6,2.77 T56.B
  Bottom 0.152: v117.12,37.52 120.32,37.52 123.6,40.79 124.36,40.79 124.89,40.26 124.89,40.11 130.3,34.7 163.83,34.7 167.34,31.19 177.7,31.19 v182.5,26.39
MUX307  (via drill 0.33)
  Top 0.152: v122.83,33.17 118.8,37.21 117.65,37.21 117.27,36.83 117.27,36.52 MUX3.11 | v133.5,33.1 133.5,32.72 145.92,20.3 v145.92,12.29 | v188.59,3.68 190.5,3.68 191.41,2.77 T57.B
  Bottom 0.152: v122.83,33.17 123.52,32.49 132.89,32.49 v133.5,33.1 | v145.92,12.29 155.14,3.07 187.99,3.07 v188.59,3.68
MUX310  (via drill 0.33)
  Top 0.152: v125.96,42.24 117.88,42.24 MUX3.13 | v196.22,3.68 195.3,2.77 T58.B
  Bottom 0.152: v125.96,42.24 190.12,42.24 206.04,26.31 206.04,6.73 203,3.68 v196.22,3.68
MUX311  (via drill 0.33)
  Top 0.152: v125.73,41.4 117.73,41.4 117.27,41.86 117.27,42.24 MUX3.14 | v200.63,4.29 199.11,2.77 T59.B
  Bottom 0.152: v125.73,41.4 125.73,41.02 125.81,40.95 125.81,40.56 129.54,36.83 194.62,36.83 205.13,26.31 205.13,8.79 v200.63,4.29
MUX312  (via drill 0.33)
  Top 0.152: v123.22,43.08 117.04,43.08 116.59,42.62 116.59,42.32 MUX3.15 | v200.03,30.58 201.02,31.57 T60.B
  Bottom 0.152: v123.22,43.08 125.5,40.79 125.5,40.41 129.39,36.52 162.92,36.52 167.03,32.41 175.87,32.41 176.17,32.72 192.02,32.72 193.01,33.71 194.08,33.71 197.21,30.58 v200.03,30.58
MUX313  (via drill 0.33)
  Top 0.152: v126.42,40.79 117.04,40.79 115.98,41.86 115.98,42.24 MUX3.16 | v161.39,32.79 v153.39,40.79 | v176.33,29.97 176.33,30.28 177.39,31.34 185.47,31.34 185.7,31.57 T61.B
  Bottom 0.152: v153.39,40.79 v126.42,40.79 | v161.39,32.79 164.21,29.97 v176.33,29.97
N$1
  Top 0.254: T13.C 52.12,29.36 52.12,27.91 53.34,26.7 N2.1
N$2
  Top 0.254: T14.C 55.93,29.36 55.93,26.39 56.92,25.4 N2.2
N$3
  Top 0.254: T15.C 59.74,4.98 59.74,9.86 60.96,11.07 60.96,15.04 60.73,15.27 N2.3
N$4
  Top 0.254: T16.C 44.5,4.98 44.5,11.07 45.26,11.84 N2.4
N$5
  Top 0.152: 9.18,19.57 13.95,24.33 13.95,26.31 N1.A2 | 9.18,19.57 9.14,19.53 7.54,19.53 5.56,21.51 5.56,25.4 R3.1 | 9.18,19.57 9.83,18.92 9.83,15.88 16.46,9.25 16.46,8.79 N1.A
N$6
  Top 0.254: T3.C 16.54,29.36 16.54,27.91 17.75,26.7 N1.1
N$7
  Top 0.254: T4.C 20.34,29.36 20.34,26.39 21.34,25.4 N1.2
N$8
  Top 0.254: T5.C 24.16,4.98 24.16,9.78 25.38,11 25.38,15.04 25.15,15.27 N1.3
N$9
  Top 0.254: T6.C 8.91,4.98 8.91,11.07 9.68,11.84 N1.4
N$10
  Top 0.254: T7.C 12.72,4.98 12.72,9.47 12.8,9.55 N1.5
N$11
  Top 0.254: T8.C 16.54,4.98 16.54,5.89 20.19,9.55 N1.6
N$12
  Top 0.254: T17.C 48.31,4.98 48.31,9.55 N2.5
N$13
  Top 0.254: T18.C 52.12,4.98 52.12,5.89 55.78,9.55 N2.6
N$14
  Top 0.254: T9.C 20.34,4.98 23.24,7.87 23.24,11.84 N1.7
N$15
  Top 0.254: T10.C 24.16,29.36 24.16,22.58 N1.8
N$16
  Top 0.254: T11.C 8.84,29.36 8.84,25.63 8.38,25.17 8.38,21.59 N1.9
N$17
  Top 0.254: T19.C 55.93,4.98 55.93,6.81 58.83,9.7 58.83,11.84 N2.7
N$18
  Top 0.254: T12.C 48.23,29.36 48.23,27.99 46.33,26.09 46.33,24.64 N2.0
N$19
  Top 0.254: T20.C 59.66,29.36 N2.8
N$20
  Top 0.254: T21.C 44.42,29.36 44.42,25.63 43.89,25.09 43.89,21.59 N2.9
N$21
  Top 0.152: 44.69,19.57 49.53,24.41 49.53,26.31 N2.A2 | 44.69,19.57 44.65,19.53 43.05,19.53 40.46,22.12 40.46,22.58 41,23.11 41,25.4 R1.1 | 44.69,19.57 46.94,17.32 46.94,14.28 52.05,9.17 52.05,8.79 N2.A
N$22
  Top 0.254: T23.C 87.63,27.99 88.92,26.7 N3.1
N$23
  Top 0.254: T24.C 91.44,26.47 92.51,25.4 N3.2
N$24
  Top 0.254: T2.C 12.65,29.36 12.65,27.91 10.74,26.01 10.74,24.64 N1.0
N$25
  Top 0.254: T25.C 95.25,9.78 96.47,11 96.47,15.04 96.24,15.27 N3.3
N$26
  Top 0.254: T26.C 80.01,4.98 81.38,4.98 82.53,6.12 82.53,8.03 80.85,9.7 80.85,11.84 N3.4
N$27
  Top 0.254: T27.C 83.82,9.47 83.9,9.55 N3.5
N$28
  Top 0.254: T28.C 87.63,5.89 91.29,9.55 N3.6
N$29
  Top 0.254: T29.C 91.44,6.73 94.41,9.7 94.41,11.84 N3.7
N$30
  Top 0.254: T22.C 83.82,27.99 81.84,26.01 81.84,24.64 N3.0
N$31
  Top 0.254: T30.C 95.25,22.58 N3.8
N$32
  Top 0.254: T31.C 80.01,25.7 79.48,25.17 79.48,21.59 N3.9
N$33
  Top 0.152: 80.28,19.57 85.11,24.41 85.11,26.31 N3.A2 | 80.28,19.57 80.24,19.53 78.64,19.53 76.66,21.51 76.66,25.4 R2.1 | N3.A 87.63,9.17 80.92,15.88 80.92,18.92 80.28,19.57
N$34
  Top 0.254: T33.C 123.22,29.36 123.22,27.91 124.44,26.7 N4.1
N$35
  Top 0.254: T34.C 127.03,29.36 127.03,26.39 128.02,25.4 N4.2
N$36
  Top 0.254: T35.C 130.84,4.98 130.84,9.78 132.06,11 132.06,15.04 131.83,15.27 N4.3
N$37
  Top 0.254: T36.C 115.59,4.98 115.59,11.07 116.36,11.84 N4.4
N$38
  Top 0.254: T37.C 119.41,4.98 119.41,9.47 119.48,9.55 N4.5
N$39
  Top 0.254: T38.C 123.22,4.98 123.22,5.89 126.87,9.55 N4.6
N$40
  Top 0.254: T39.C 127.03,4.98 127.03,6.81 129.92,9.7 129.92,11.84 N4.7
N$41
  Top 0.254: T32.C 119.33,29.36 119.33,27.91 117.42,26.01 117.42,24.64 N4.0
N$42
  Top 0.254: T40.C 130.84,29.36 130.84,22.58 N4.8
N$43
  Top 0.254: T41.C 115.52,29.36 115.52,25.63 115.06,25.17 115.06,21.59 N4.9
N$44
  Top 0.152: 115.86,19.57 120.62,24.33 120.62,26.31 N4.A2 | 115.86,19.57 115.82,19.53 114.22,19.53 111.48,22.28 111.48,24.33 112.17,25.02 112.17,25.4 R4.1 | 115.86,19.57 116.51,18.92 116.51,15.88 123.14,9.25 123.14,8.79 N4.A
N$45
  Top 0.254: T43.C 158.8,29.36 158.8,27.91 160.02,26.7 N5.1
N$46
  Top 0.254: T44.C 162.61,29.36 162.61,26.39 163.6,25.4 N5.2
N$47
  Top 0.254: T45.C 166.42,4.98 166.42,9.86 167.64,11.07 167.64,15.04 167.41,15.27 N5.3
N$48
  Top 0.254: T46.C 151.18,4.98 151.18,11.07 151.94,11.84 N5.4
N$49
  Top 0.254: T47.C 154.99,4.98 154.99,9.55 N5.5
N$50
  Top 0.254: T48.C 158.8,4.98 158.8,5.89 162.46,9.55 N5.6
N$51
  Top 0.254: T49.C 162.61,4.98 162.61,6.81 165.51,9.7 165.51,11.84 N5.7
N$52
  Top 0.254: T42.C 154.91,29.36 154.91,27.99 153.01,26.09 153.01,24.64 N5.0
N$53
  Top 0.254: T50.C 166.34,29.36 N5.8
N$54
  Top 0.254: T51.C 151.1,29.36 151.1,25.63 150.57,25.09 150.57,21.59 N5.9
N$55
  Top 0.152: 151.37,19.57 156.21,24.41 156.21,26.31 N5.A2 | 151.37,19.57 151.33,19.53 148.06,19.53 145.24,22.35 145.24,22.81 147.68,25.25 147.68,25.4 R5.1 | 151.37,19.57 153.62,17.32 153.62,14.28 158.72,9.17 158.72,8.79 N5.A
N$56
  Top 0.254: T53.C 194.31,27.99 195.6,26.7 N6.1
N$57
  Top 0.254: T54.C 198.12,26.47 199.19,25.4 N6.2
N$58
  Top 0.254: T55.C 201.93,9.78 203.15,11 203.15,15.04 202.92,15.27 N6.3
N$59
  Top 0.254: T56.C 186.69,11.07 187.45,11.84 N6.4
N$60
  Top 0.254: T57.C 190.5,9.47 190.58,9.55 N6.5
N$61
  Top 0.254: T58.C 194.31,5.89 197.97,9.55 N6.6
N$62
  Top 0.254: T59.C 198.12,6.73 201.09,9.7 201.09,11.84 N6.7
N$63
  Top 0.254: T52.C 190.5,27.99 188.52,26.01 188.52,24.64 N6.0
N$64
  Top 0.254: T60.C 201.93,22.58 N6.8
N$65
  Top 0.254: T61.C 186.69,25.7 186.16,25.17 186.16,21.59 N6.9
N$66
  Top 0.152: 186.96,19.57 191.79,24.41 191.79,26.31 N6.A2 | 186.96,19.57 186.92,19.53 185.32,19.53 183.34,21.51 183.34,25.4 R6.1 | N6.A 194.31,9.17 187.6,15.88 187.6,18.92 186.96,19.57
N$70
  Top 0.152: R24.2 29.57,41.94 28.35,41.94 25.45,44.83 R23.1 25.38,44.83 22.71,44.83 Q1.1
N$71
  Top 0.152: R24.1 31.39,41.94 31.39,45.52 31.55,45.67 T1.C
N$72  (via drill 0.33)
  Top 0.152: v79.17,47.04 80.39,48.26 R25.2 | v47.85,47.04 29.72,47.04 29.41,46.74 T1.B
  Bottom 0.152: v47.85,47.04 v79.17,47.04
N$73
  Top 0.152: R26.1 56.24,16.56 56.24,21.29 53.95,23.57 53.8,23.57 D2.4
N$83
  Top 0.152: R29.2 47.85,16.56 47.85,21.29 50.14,23.57 50.37,23.57 D2.1
N$84
  Top 0.152: R30.2 53.8,13.97 53.8,15.27 55.09,16.56 55.09,20.83 53.8,22.12 D2.3
N$85
  Top 0.152: R31.2 50.37,13.97 50.37,15.27 49.07,16.56 49.07,20.83 D2.2
N$86
  Top 0.152: R33.1 20.73,16.56 20.73,21.29 18.44,23.57 18.21,23.57 D3.4
N$87
  Top 0.152: R27.2 12.34,16.56 12.34,21.29 14.63,23.57 14.78,23.57 D3.1
N$88
  Top 0.152: R28.2 18.21,13.97 18.21,15.27 19.51,16.56 19.51,20.83 D3.3
N$89
  Top 0.152: R32.2 14.78,13.97 14.78,15.27 13.49,16.56 13.49,20.83 14.78,22.12 D3.2
N$90
  Top 0.152: R37.1 91.82,16.56 91.82,21.29 89.53,23.57 89.38,23.57 D4.4
N$91
  Top 0.152: R34.2 83.44,16.56 83.44,21.29 85.72,23.57 85.88,23.57 D4.1
N$92
  Top 0.152: R35.2 89.38,13.97 89.38,15.34 90.6,16.56 90.6,20.9 89.38,22.12 D4.3
N$93
  Top 0.152: R36.2 85.88,13.97 85.88,15.34 84.66,16.56 84.66,20.9 85.88,22.12 D4.2
N$94
  Top 0.152: R41.1 127.41,16.56 127.41,21.29 125.12,23.57 124.89,23.57 D5.4
N$95
  Top 0.152: R38.2 119.02,16.56 119.02,21.29 121.31,23.57 121.46,23.57 D5.1
N$96
  Top 0.152: R39.2 124.89,13.97 124.89,15.27 126.19,16.56 126.19,20.83 D5.3
N$97
  Top 0.152: R40.2 121.46,13.97 121.46,15.27 120.17,16.56 120.17,20.83 121.46,22.12 D5.2
N$98
  Top 0.152: R45.1 162.92,16.56 162.92,21.29 160.63,23.57 160.48,23.57 D6.4
N$99
  Top 0.152: R42.2 154.53,16.56 154.53,21.29 156.82,23.57 157.05,23.57 D6.1
N$100
  Top 0.152: R43.2 160.48,13.97 160.48,15.27 161.77,16.56 161.77,20.83 160.48,22.12 D6.3
N$101
  Top 0.152: R44.2 157.05,13.97 157.05,15.27 155.75,16.56 155.75,20.83 D6.2
N$102
  Top 0.152: R49.1 198.5,16.56 198.5,21.29 196.22,23.57 196.06,23.57 D7.4
N$103
  Top 0.152: R46.2 190.12,16.56 190.12,21.29 192.41,23.57 192.56,23.57 D7.1
N$104
  Top 0.152: R47.2 196.06,13.97 196.06,15.34 197.28,16.56 197.28,20.9 196.06,22.12 D7.3
N$105
  Top 0.152: R48.2 192.56,13.97 192.56,15.34 191.34,16.56 191.34,20.9 192.56,22.12 D7.2
NIXIE_PWR  (via drill 0.33)
  Top 0.152: v113.92,26.47 113.92,25.4 R4.2 113.61,25.4 112.32,24.11 v112.09,24.11 | v145.85,22.58 146.61,22.58 149.43,25.4 | R6.2 184.71,25.4 183.11,27 v176.33,27 | 149.43,25.4 v150.34,26.31 | 149.43,25.4 R5.2 | v7.24,28.6 7.24,25.4 R3.2 | v14.25,35.61 14.25,39.5 20.42,45.67 Q1.3 | v36.88,31.27 42.75,25.4 R1.2 | 77.46,26.43 77.34,26.54 v60.43,26.54 | 77.46,26.43 78.26,25.63 78.26,25.4 R2.2 | 77.46,26.43 v78.18,27.15
  Bottom 0.152: v113.92,26.47 114.07,26.47 116.59,28.98 139.45,28.98 v145.85,22.58 | v176.33,27 165.35,27 163.37,28.98 153.01,28.98 v150.34,26.31 | v7.24,28.6 v14.25,35.61 14.25,35.53 30.56,35.53 34.82,31.27 v36.88,31.27 40.23,34.62 46.33,34.62 48.77,32.18 53.95,32.18 59.59,26.54 v60.43,26.54 | v112.09,24.11 98.53,24.11 87.33,35.31 87.33,35.53 86.94,35.92 86.49,35.92 78.18,27.61 v78.18,27.15
NIXIE_PWR_PWM
  Top 0.152: R25.1 84.2,48.26 85.19,47.27 87.71,47.27 87.94,47.5 87.94,48.18 U2.6
PTA0
  Top 0.152: J2.9 102.87,68.68 105.23,66.32 105.23,62.89 102.11,59.77 102.11,56.19 99.82,53.9 99.14,53.9 U2.34
PTA2  (via drill 0.33)
  Top 0.152: v94.41,60.3 94.41,58.78 98.3,54.89 U2.36 | v101.58,67.46 101.58,69.14 J2.8
  Bottom 0.152: v101.58,67.46 v94.41,60.3
PTA3  (via drill 0.33)
  Top 0.152: v101.8,60.3 101.35,59.84 101.35,56.95 99.82,55.42 99.14,55.42 U2.37 | v104.78,67.61 104.78,68.53 104.17,69.14 J2.10
  Bottom 0.152: v101.8,60.3 101.8,64.64 v104.78,67.61
RESET
  Top 0.152: 100.17,67.58 99.06,68.68 J2.6 | 100.17,67.58 103.78,63.96 104.09,63.96 R15.1 | 100.17,67.58 97,64.41 97,63.58 U2.52
SCL  (via drill 0.33)
  Top 0.152: v69.19,47.88 66.14,44.83 66.14,43.08 66.29,42.93 66.29,42.32 MUX0.22 | v80.31,60.45 81.23,61.37 R22.1 | v81.53,43.31 81.53,42.32 MUX1.22 | 96.28,41.44 96.09,41.25 v88.01,41.25 | 96.28,41.44 96.77,41.94 96.77,42.24 MUX2.22 | v99.97,40.41 110.49,40.41 112.01,41.94 112.01,42.24 MUX3.22 | v97.92,40.64 97.08,40.64 96.28,41.44 | v95.25,62.2 95.4,62.36 95.4,63.5 U2.55
  Bottom 0.152: v69.19,47.88 78.87,57.56 78.87,59 79.44,59.58 | 79.44,59.58 v80.31,60.45 82.07,62.2 v95.25,62.2 | 79.44,59.58 81.53,57.48 v81.53,43.31 83.59,41.25 v88.01,41.25 | v99.97,40.41 99.14,40.41 98.91,40.64 v97.92,40.64
SDA  (via drill 0.33)
  Top 0.152: v109.5,42.47 110.41,41.55 111.02,41.55 111.33,41.86 111.33,42.24 MUX3.23 | v96.24,60.38 94.64,61.98 94.64,62.43 94.87,62.66 94.87,63.5 U2.56 | v66.29,41.25 65.68,41.86 65.68,42.24 MUX0.23 | MUX1.23 80.85,42.32 80.7,42.47 v80.7,43.31 81.99,44.6 86.11,44.6 89.15,41.55 95.78,41.55 96.09,41.86 96.09,42.24 MUX2.23 96.16,42.32 96.24,42.39 v96.24,43.31 | v79.48,58.7 78.79,59.38 78.79,61.37 R21.1
  Bottom 0.152: v109.5,42.47 109.5,44.15 98.37,55.27 98.37,56.87 | 98.37,56.87 98.37,59.08 97.08,60.38 v96.24,60.38 | v66.29,41.25 66.9,41.25 68.96,43.31 80.31,43.31 | v80.7,43.31 80.31,43.31 | v79.48,58.7 79.48,55.42 80.31,54.59 80.31,43.31 | 98.37,56.87 97.54,56.87 96.24,55.58 v96.24,43.31
SHDN  (via drill 0.33)
  Top 0.152: R16.1 53.34,41.1 50.37,41.1 50.14,41.33 U$1.SHDN | v73.61,45.44 82.98,54.81 83.74,54.81 U2.90
  Bottom 0.152: v73.61,45.44 73,45.44 71.48,43.92 52.65,43.92 50.14,41.4 U$1.SHDN
V170  (via drill 0.33)
  Top 0.254: 24.31,46.58 22.78,46.58 22.71,46.66 Q1.2 | 24.31,46.58 25.38,46.58 R23.2 | v24.31,45.74 24.31,46.58
  Bottom 0.254: v24.31,45.74 24.31,43.23 25.53,42.01 U$1.VH
VCC
  Top 0.152: C9.1 93.5,45.74 93.27,45.74 91.75,47.27 91.67,47.27 91.44,47.5 U2.13 91.44,55.5 84.66,62.28 78.11,62.28 74.37,66.02 69.88,66.02 U1.3
VDD  (via drill 0.33)
  Top 0.152: MUX3.24 110.8,42.32 110.8,42.7 111.18,43.08 112.24,43.08 112.62,42.7 112.62,42.32 MUX3.21 112.7,42.24 112.93,42.01 v112.93,41.25 | v128.02,17.63 129.08,16.56 R41.2 | v163.53,17.7 164.67,16.56 R45.2 | v199.11,17.63 200.18,16.56 R49.2 | 100.05,60.91 99.14,60.91 U2.48 | 100.05,60.91 102.56,60.91 104.93,63.27 104.93,64.57 104.17,65.33 104.17,65.56 R15.2 104.09,65.63 102.26,67.46 102.26,70.28 101,71.54 | 100.05,60.91 100.05,57.1 99.9,56.95 99.14,56.95 U2.40 | 101,71.54 100.97,71.58 100.97,74.24 101.12,74.4 103.33,74.4 104.09,73.64 104.09,73.1 J2.1 104.17,73.03 106.15,71.04 106.15,56.03 105.39,55.27 105.39,55.12 C8.1 105.39,55.04 102.87,55.04 C3.1 C4.1 102.87,51.61 v103.94,50.55 | 97.35,50.89 98.3,51.84 99.06,51.84 U2.30 | 97.35,50.89 96.74,50.28 | 96.74,50.28 96.01,49.55 96.01,48.26 U2.22 | 96.74,50.28 97.84,49.17 97.84,47.12 97,46.28 97,45.74 C7.1 96.93,45.67 95.56,44.3 95.56,42.32 MUX2.24 95.48,42.32 v89.23,42.32 | 92.43,64.49 92.43,65.48 91.9,66.02 C1.1 91.9,66.09 91.9,68.53 C2.1 91.97,68.53 94.94,71.5 100.97,71.5 101,71.54 | 92.43,64.49 92.43,63.58 U2.61 | R21.2 78.79,63.12 81.23,63.12 R22.2 81.31,63.12 81.69,63.5 85.42,63.5 U2.75 | 92.43,64.49 85.65,64.49 85.5,64.34 85.5,63.58 U2.75 | 97.35,50.89 85.42,62.81 85.42,63.42 U2.75 | 80.58,41.59 80.62,41.55 81.84,41.55 82.14,41.86 82.14,42.24 MUX1.21 | 80.58,41.59 80.31,41.86 80.31,42.24 MUX1.24 | v92.43,17.63 93.5,16.56 R37.2 | 80.58,41.59 v80.24,41.25 | 88.54,46.74 88.54,47.12 88.92,47.5 88.92,48.18 U2.8 88.92,48.26 88.92,51 84.58,55.35 83.82,55.35 U2.89 83.74,55.35 83.06,55.35 82.75,55.04 81.31,55.04 C6.1 81.23,55.04 71.93,55.04 69.88,57.1 U4.3 69.8,57.1 68.96,57.1 62.1,50.24 60.81,50.24 53.34,42.77 R16.2 53.34,42.7 46.33,42.7 v32.46,28.83
  Top 0.152: 88.54,46.74 88.54,45.74 C5.1 | v69.19,48.72 65.08,44.6 65.08,42.32 MUX0.24 | v21.34,17.63 22.4,16.56 R33.2 | v56.84,17.7 57.99,16.56 R26.2 | 88.54,46.74 v88.62,46.74
  Bottom 0.152: v128.02,17.63 127.56,17.63 124.44,20.75 117.04,20.75 115.82,19.53 114.22,19.53 112.93,20.83 112.93,29.29 | 112.93,29.29 v112.93,41.25 112.93,41.55 v103.94,50.55 | v163.53,17.7 163.07,17.7 160.02,20.75 152.55,20.75 151.33,19.53 149.73,19.53 147.41,21.86 | 147.41,21.86 139.98,29.29 112.93,29.29 | v199.11,17.63 198.65,17.63 195.53,20.75 188.14,20.75 186.92,19.53 172.36,19.53 163.22,28.68 154.23,28.68 147.41,21.86 | v92.43,17.63 91.97,17.63 88.85,20.75 81.46,20.75 80.24,19.53 78.64,19.53 77.27,20.9 77.27,38.28 v80.24,41.25 80.24,41.17 81.92,41.17 83.06,40.03 87.63,40.03 88.62,41.02 88.62,42.32 | v69.19,48.72 69.19,56.49 U4.3 | v21.34,17.63 20.88,17.63 17.75,20.75 10.36,20.75 9.14,19.53 7.54,19.53 6.25,20.83 6.25,22.96 12.12,28.83 v32.46,28.83 37.57,23.72 40.54,23.72 41.68,22.58 41.68,20.9 43.05,19.53 44.65,19.53 45.87,20.75 53.34,20.75 56.39,17.7 v56.84,17.7 | v88.62,46.74 88.62,42.32 | 88.62,42.32 v89.23,42.32